# Altium schematic sheet Neutro.SchDoc
size A4
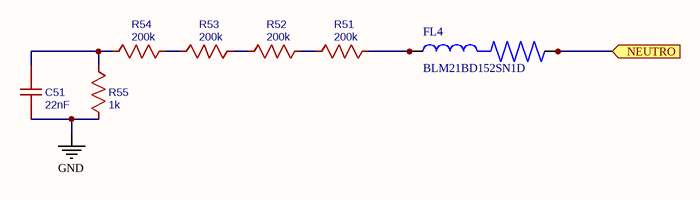
[diagram p0: Neutro.SchDoc]

## Parts
C51  22nF  [CAPC3216X190]
FL4  BLM21BD152SN1D  [BEADC2012X105N]
R51  200k  [RESC3216X75N]
R52  200k  [RESC3216X75N]
R53  200k  [RESC3216X75N]
R54  200k  [RESC3216X75N]
R55  1k  [RESC3216X75N]

## Ports
NEUTRO (in)

## Nets
GND: C51.1 R55.1
NEUTRO: FL4.1 ; port NEUTRO
NetC51_2: C51.2 R54.1 R55.2
NetFL4_2: FL4.2 R51.2
NetR51_1: R51.1 R52.2
NetR52_1: R52.1 R53.2
NetR53_1: R53.1 R54.2

## Library data of the parts
C51 = 22nF: nameAlias: Value(F); spicePre: C; spiceSymbolName: Cap_RAD-0.1_US
FL4 = BLM21BD152SN1D: 1.5 kOhms @ 100MHz 1 Signal Line Ferrite Bead 0805 (2012 Metric) 250mA 450mOhm; MF: Murata; Availability: Good; Check_prices: https://www.snapeda.com/parts/BLM21BD152SN1D/Murata/view-part/290529/?ref=eda; Value: *; Package: 2012 Murata; MP: BLM21BD152SN1D; Price: None; SnapEDA_Link: https://www.snapeda.com/parts/BLM21BD152SN1D/Murata/view-part/290529/?ref=snap; Purchase-URL: https://pricing.snapeda.com/search/part/BLM21BD152SN1D/?ref=eda
R51-R54 = 330k: nameAlias: Value(Ω); spicePre: R; spiceSymbolName: Res_AXIAL-0.3(1/8W)_US
R55 = 1k: nameAlias: Value(Ω); spicePre: R; spiceSymbolName: Res_AXIAL-0.3(1/8W)_US